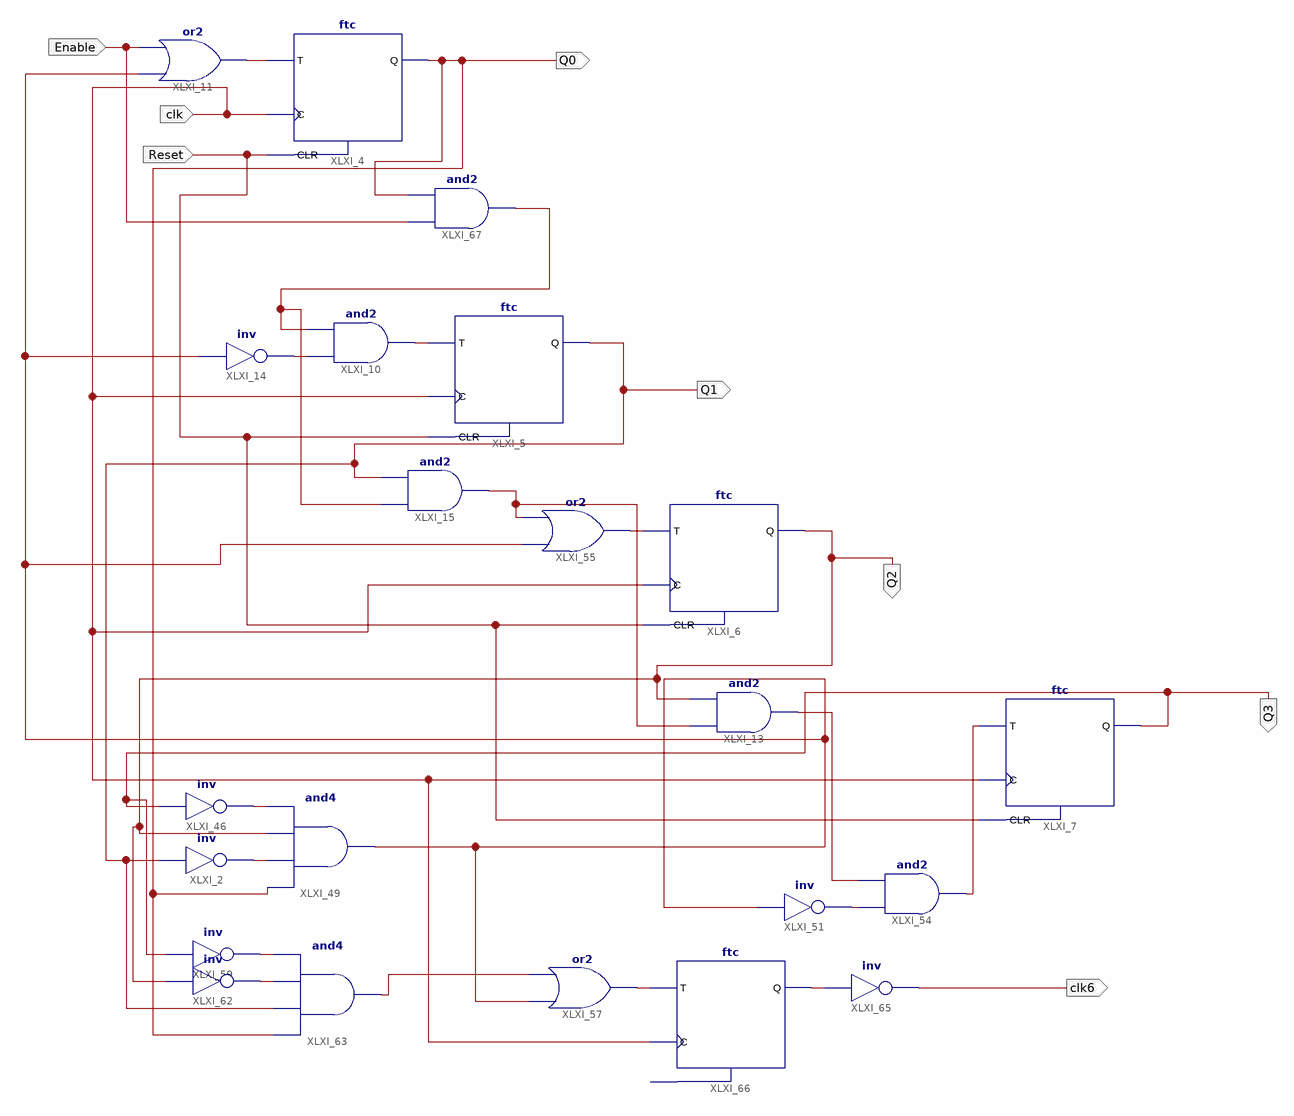
[diagram p0: schematic sheet 1]
// Xilinx ISE schematic Modulo6.sch (spartan6) as structural Verilog: 22 symbols, 8 ports
module Modulo6 (
  input  Enable,
  input  clk,
  input  Reset,
  output Q1,
  output Q3,
  output Q2,
  output clk6,
  output Q0
);

  wire EoC, XLXN_1, XLXN_3, XLXN_4, XLXN_5, XLXN_6, XLXN_8, XLXN_9, XLXN_12, XLXN_38, XLXN_44, XLXN_45,
       XLXN_48, XLXN_51, XLXN_56, XLXN_57, XLXN_60;

  ftc XLXI_4 (.C(clk), .CLR(Reset), .T(XLXN_3), .Q(Q0));
  ftc XLXI_5 (.C(clk), .CLR(Reset), .T(XLXN_6), .Q(Q1));
  ftc XLXI_6 (.C(clk), .CLR(Reset), .T(XLXN_5), .Q(Q2));
  ftc XLXI_7 (.C(clk), .CLR(Reset), .T(XLXN_4), .Q(Q3));
  and XLXI_10 (XLXN_6, XLXN_12, XLXN_60);
  or XLXI_11 (XLXN_3, EoC, Enable);
  and XLXI_13 (XLXN_9, XLXN_8, Q2);
  not XLXI_14 (XLXN_12, EoC);
  and XLXI_15 (XLXN_8, XLXN_60, Q1);
  not XLXI_2 (XLXN_1, Q1);
  not XLXI_46 (XLXN_38, Q3);
  and XLXI_49 (EoC, Q0, XLXN_1, Q2, XLXN_38);
  not XLXI_51 (XLXN_44, EoC);
  and XLXI_54 (XLXN_4, XLXN_44, XLXN_9);
  or XLXI_55 (XLXN_5, EoC, XLXN_8);
  or XLXI_57 (XLXN_48, EoC, XLXN_45);
  not XLXI_59 (XLXN_51, Q3);
  not XLXI_62 (XLXN_56, Q2);
  and XLXI_63 (XLXN_45, Q0, Q1, XLXN_56, XLXN_51);
  not XLXI_65 (clk6, XLXN_57);
  ftc XLXI_66 (.C(clk), .T(XLXN_48), .Q(XLXN_57));  // open: CLR
  and XLXI_67 (XLXN_60, Enable, Q0);
endmodule
